# Altium schematic sheet Fri3d_2020_Time_Blaster_01.SchDoc: Time Blaster
size A3; Date: 08/01/2020; DrawnBy: Wim Van Gool; DocumentNumber: 1; Revision: 00; SheetNumber: 1; SheetTotal: 1
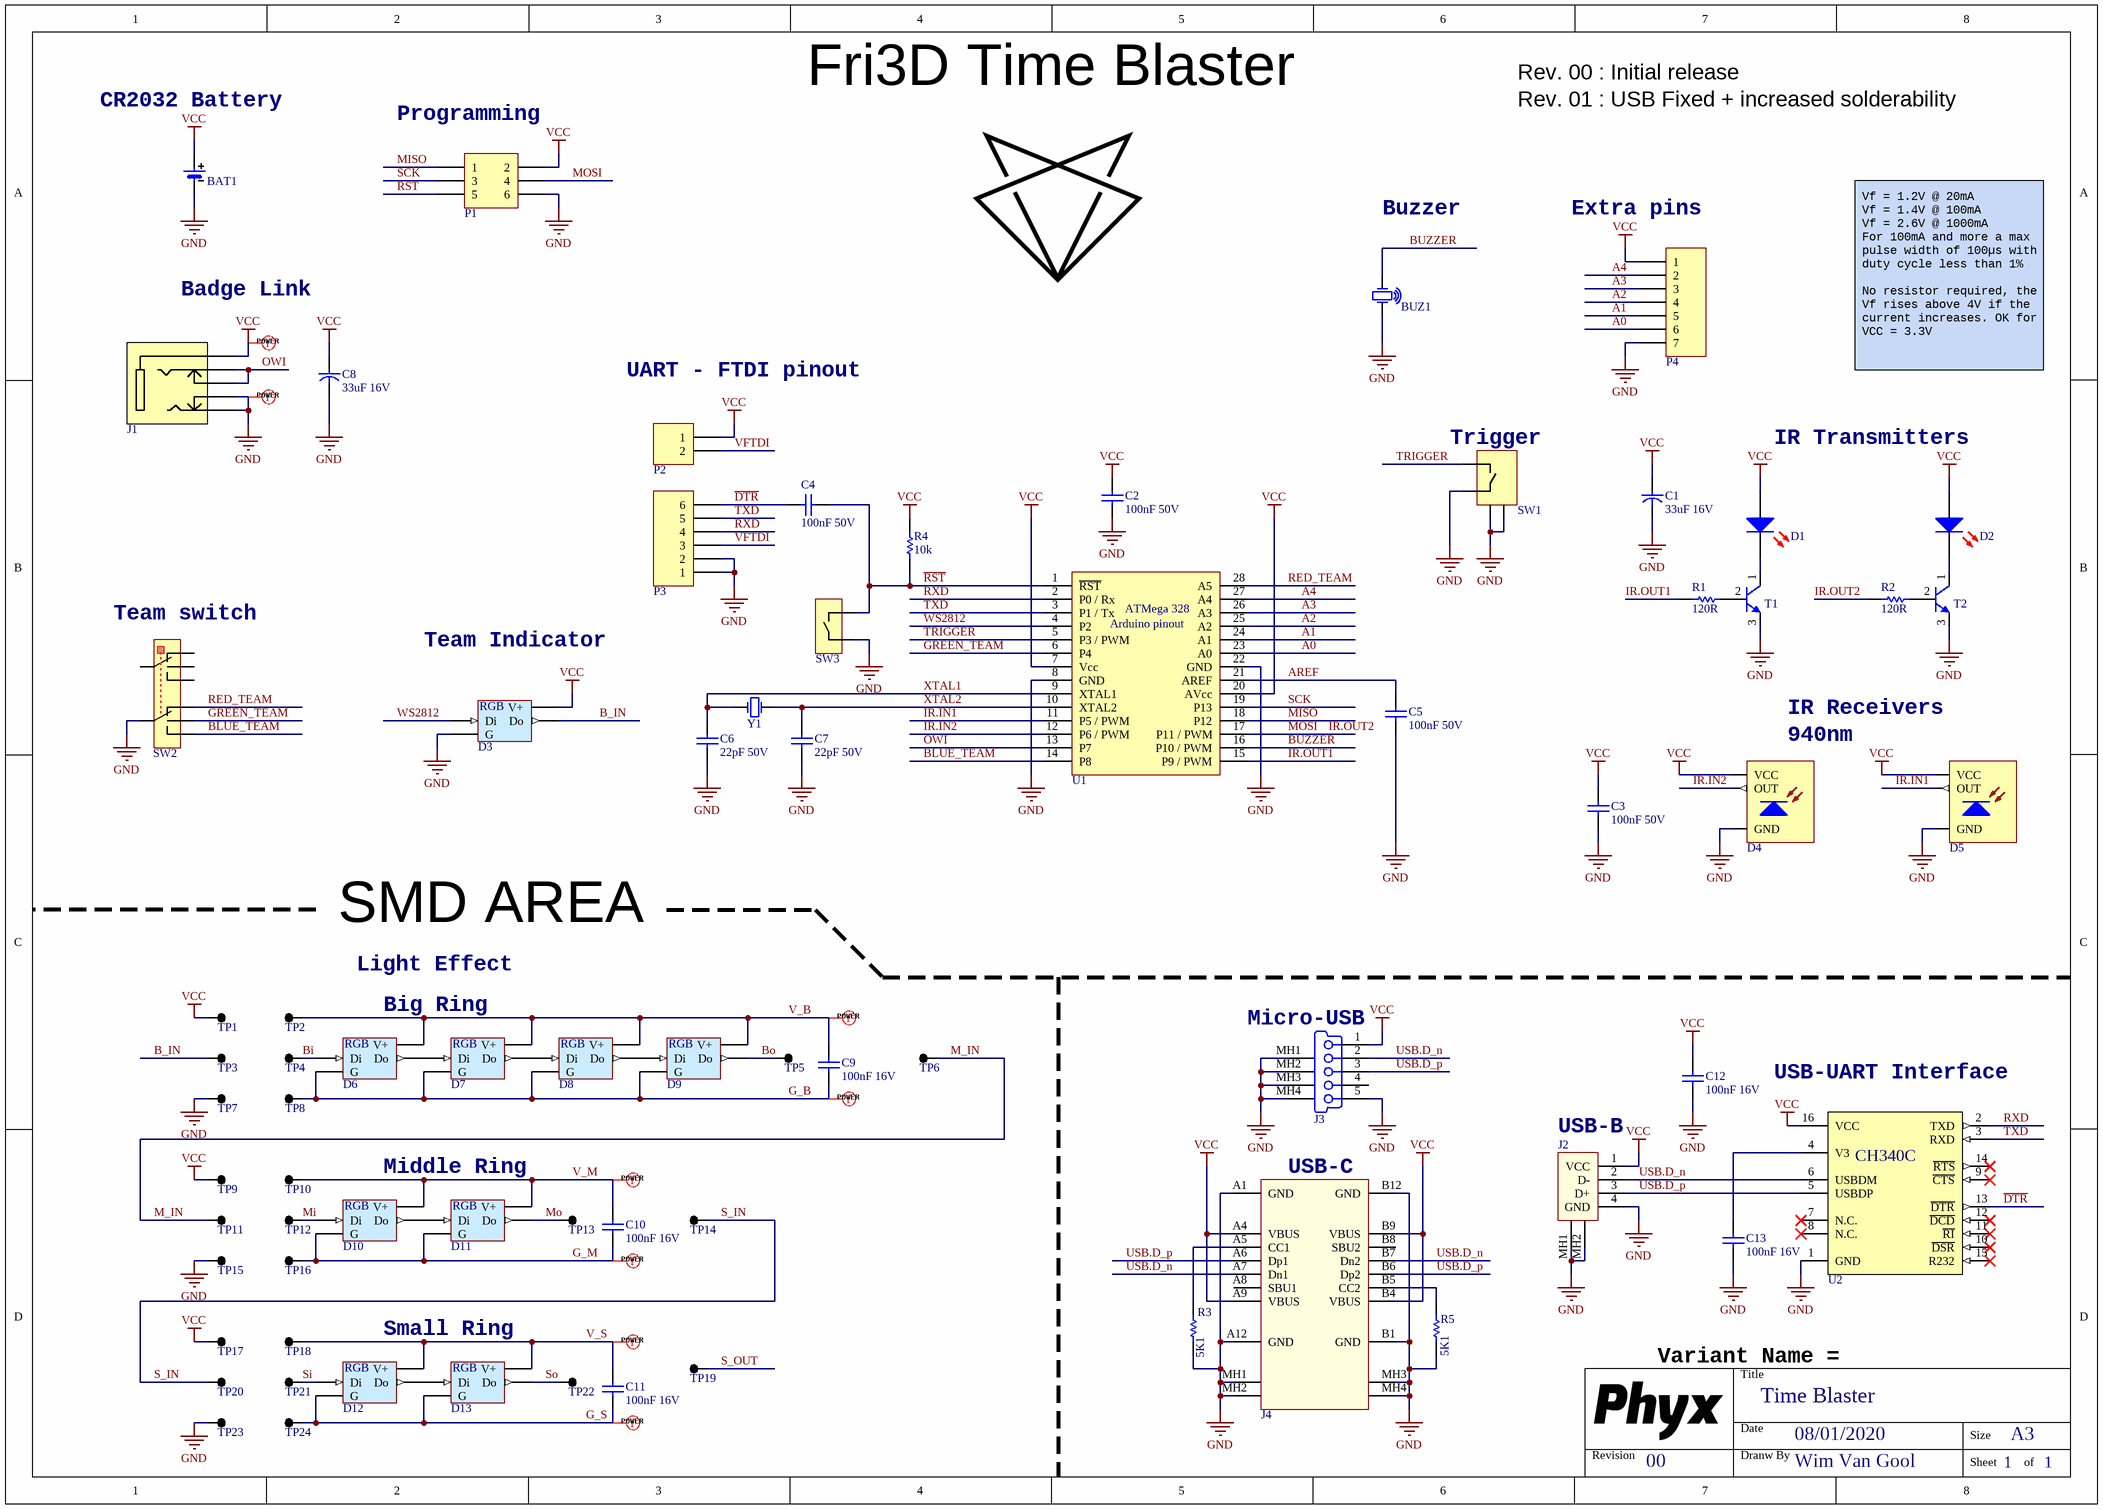
[diagram p0: Fri3d_2020_Time_Blaster_01.SchDoc]

## Parts
BAT1  CR2032 Battery Holder  [BAT_CR2032_China]  (value not drawn)
BUZ1  14x14x7mm Piezo Buzzer Transducer 80dB  [CUI_CEP-1162]  (value not drawn)
C1  value 33uF 16V  [C_4x7_1.5mm]  (hidden comment: CAP_POL)
C2  value 100nF 50V  [C_5.08mm]  (hidden comment: CAP_CERAMIC)
C3  value 100nF 50V  [C_5.08mm]  (hidden comment: CAP_CERAMIC)
C4  value 100nF 50V  [C_5.08mm]  (hidden comment: CAP_CERAMIC)
C5  value 100nF 50V  [C_5.08mm]  (hidden comment: CAP_CERAMIC)
C6  value 22pF 50V  [C_5.08mm]  (hidden comment: CAP_CERAMIC)
C7  value 22pF 50V  [C_5.08mm]  (hidden comment: CAP_CERAMIC)
C8  value 33uF 16V  [C_4x7_1.5mm]  (hidden comment: CAP_POL)
C9  value 100nF 16V  [C0805_N]  (hidden comment: CAP_CERAMIC)
C10  value 100nF 16V  [C0805_N]  (hidden comment: CAP_CERAMIC)
C11  value 100nF 16V  [C0805_N]  (hidden comment: CAP_CERAMIC)
C12  value 100nF 16V  [C0805_N]  (hidden comment: CAP_CERAMIC)
C13  value 100nF 16V  [C0805_N]  (hidden comment: CAP_CERAMIC)
D1  5mm IR LED, 940nm, 100mA, 1.35V, 25Deg  [LED_5MM_RD]  (value not drawn)
D2  5mm IR LED, 940nm, 100mA, 1.35V, 25Deg  [LED_5MM_RD]  (value not drawn)
D3  WS2812 based digital RGB LED 5mm  [LED_5mm_RGB]  (value not drawn)
D4  IRM-3638N3F14 Infrared Receiver 38 kHz 45° 2.7-5.5V  [VIS_TSOP381x_BENT]  (value not drawn)
D5  IRM-3638N3F14 Infrared Receiver 38 kHz 45° 2.7-5.5V  [VIS_TSOP381x_BENT]  (value not drawn)
D6  WS2812 based digital RGB LED 5050 Black package  [LED_5050_WS2812B_BLACK]  (value not drawn)
D7  WS2812 based digital RGB LED 5050 Black package  [LED_5050_WS2812B_BLACK]  (value not drawn)
D8  WS2812 based digital RGB LED 5050 Black package  [LED_5050_WS2812B_BLACK]  (value not drawn)
D9  WS2812 based digital RGB LED 5050 Black package  [LED_5050_WS2812B_BLACK]  (value not drawn)
D10  WS2812 based digital RGB LED 5050 Black package  [LED_5050_WS2812B_BLACK]  (value not drawn)
D11  WS2812 based digital RGB LED 5050 Black package  [LED_5050_WS2812B_BLACK]  (value not drawn)
D12  WS2812 based digital RGB LED 5050 Black package  [LED_5050_WS2812B_BLACK]  (value not drawn)
D13  WS2812 based digital RGB LED 5050 Black package  [LED_5050_WS2812B_BLACK]  (value not drawn)
J1  3.5mm jack, dual switch, black, 3 contacts  [CUI_SJ1-3525NG]  (value not drawn)
J2  Vertical USB B 61400416121  [WE_61400416121]  (value not drawn)
J3  XKB U254-051T-4BH81-S2S Micro USB  [XKB_U254-051T-4BH81-S2S]  (value not drawn)
J4  USB 2.0 C Reversible Receptacle Horizontal  [HRO_TYPE-C-31-M-12]  (value not drawn)
P1  Boxed Header 3X2  [B_HDR2X3]  (value not drawn)
P2  Easy to solder connection  [SOLDER_SW_V_1MM]  (value not drawn)
P3  Header 6  [HDR1X6]  (value not drawn)
P4  Header 7  [HDR1X7]  (value not drawn)
R1  value 120R  [RES_10mm]  (hidden comment: RESISTOR)
R2  value 120R  [RES_10mm]  (hidden comment: RESISTOR)
R3  value 5K1  [R0805_N]  (hidden comment: RESISTOR)
R4  value 10k  [RES_10mm]  (hidden comment: RESISTOR)
R5  value 5K1  [R0805_N]  (hidden comment: RESISTOR)
SW1  Tact switch, RA, 3,85mm  [TACTSW_RA_385]  (value not drawn)
SW2  Slide switch dual pole triple throw  [CK_JS203011CQN]  (value not drawn)
SW3  Default TH TACT  [TACTSW]  (value not drawn)
T1  0.2A 40V 100hfe NPN Transistor  [TO-92A _EASY]  (value not drawn)
T2  0.2A 40V 100hfe NPN Transistor  [TO-92A _EASY]  (value not drawn)
TP1  TEST_PAD  [TP_2x3mm]  (value not drawn)  (no BOM)
TP2  TEST_PAD  [TP_2x3mm]  (value not drawn)  (no BOM)
TP3  TEST_PAD  [TP_2x3mm]  (value not drawn)  (no BOM)
TP4  TEST_PAD  [TP_2x3mm]  (value not drawn)  (no BOM)
TP5  TEST_PAD  [TP_2x3mm]  (value not drawn)  (no BOM)
TP6  TEST_PAD  [TP_2x3mm]  (value not drawn)  (no BOM)
TP7  TEST_PAD  [TP_2x3mm]  (value not drawn)  (no BOM)
TP8  TEST_PAD  [TP_2x3mm]  (value not drawn)  (no BOM)
TP9  TEST_PAD  [TP_2x3mm]  (value not drawn)  (no BOM)
TP10  TEST_PAD  [TP_2x3mm]  (value not drawn)  (no BOM)
TP11  TEST_PAD  [TP_2x3mm]  (value not drawn)  (no BOM)
TP12  TEST_PAD  [TP_2x3mm]  (value not drawn)  (no BOM)
TP13  TEST_PAD  [TP_2x3mm]  (value not drawn)  (no BOM)
TP14  TEST_PAD  [TP_2x3mm]  (value not drawn)  (no BOM)
TP15  TEST_PAD  [TP_2x3mm]  (value not drawn)  (no BOM)
TP16  TEST_PAD  [TP_2x3mm]  (value not drawn)  (no BOM)
TP17  TEST_PAD  [TP_2x3mm]  (value not drawn)  (no BOM)
TP18  TEST_PAD  [TP_2x3mm]  (value not drawn)  (no BOM)
TP19  TEST_PAD  [TP_2x3mm]  (value not drawn)  (no BOM)
TP20  TEST_PAD  [TP_2x3mm]  (value not drawn)  (no BOM)
TP21  TEST_PAD  [TP_2x3mm]  (value not drawn)  (no BOM)
TP22  TEST_PAD  [TP_2x3mm]  (value not drawn)  (no BOM)
TP23  TEST_PAD  [TP_2x3mm]  (value not drawn)  (no BOM)
TP24  TEST_PAD  [TP_2x3mm]  (value not drawn)  (no BOM)
U1  8-bit MCU  [DIP_N_28]  (value not drawn)
U2  USB to full UART with internal crystal  [SOIC_N_16]  (value not drawn)
Y1  16MHz 18pF HC49US  [HC49US]  (value not drawn)

## Nets
GND: BAT1.2 BUZ1.1(OSC1) C1.2 C2.2 C3.2 C5.2 C6.2 C7.2 C8.2 C12.2 C13.2 D3.3(G) D4.2(GND) D5.2(GND) J1.2(Tip) J1.4 J2.4(GND) J2.MH1(Tab) J2.MH2(Tab) J3.5(GND) J3.MH1(Tab) J3.MH2(Tab) J3.MH3(Tab) J3.MH4(Tab) J4.A1(GND) J4.A12(GND) J4.B1(GND) J4.B12(GND) J4.MH1(Tab) J4.MH2(Tab) J4.MH3(Tab) J4.MH4(Tab) P1.6 P3.1 P3.2 P4.7 R3.2 R5.2 SW1.2 SW1.MH1 SW1.MH2 SW2.7 SW3.2 T1.3(E) T2.3(E) TP7.1 TP15.1 TP23.1 U1.8(GND) U1.22(GND) U2.1(GND)
VCC: BAT1.1 C1.1 C2.1 C3.1 C8.1 C12.1 D1.1(A) D2.1(A) D3.2(V+) D4.3(VCC) D5.3(VCC) J1.1(Sleeve) J2.1(VCC) J3.1(V_BUS_(5V)) J4.A4(VBUS) J4.A9(VBUS) J4.B4(VBUS) J4.B9(VBUS) P1.2 P2.1 P4.1 R4.1 TP1.1 TP9.1 TP17.1 U1.7(Vcc) U1.20(AVcc) U2.16(VCC)
A0: P4.6 U1.23(A0)
A1: P4.5 U1.24(A1)
A2: P4.4 U1.25(A2)
A3: P4.3 U1.26(A3)
A4: P4.2 U1.27(A4)
AREF: C5.1 U1.21(AREF)
B_IN: D3.1(Do) TP3.1
Bi: D6.4(Di) TP4.1
BLUE_TEAM: SW2.8 U1.14(P8)
Bo: D9.2(Do) TP5.1
BUZZER: BUZ1.2(OSC2) U1.16(P10_/_PWM)
~{DTR}: C4.2 P3.6 U2.13(~{DTR})
G_B: C9.2 D6.3(G) D7.3(G) D8.3(G) D9.3(G) TP8.1
G_M: C10.2 D10.3(G) D11.3(G) TP16.1
G_S: C11.2 D12.3(G) D13.3(G) TP24.1
GREEN_TEAM: SW2.6 U1.6(P4)
IR.IN1: D5.1(OUT) U1.11(P5_/_PWM)
IR.IN2: D4.1(OUT) U1.12(P6_/_PWM)
IR.OUT1: R1.2 U1.15(P9_/_PWM)
IR.OUT2: P1.4 R2.2 U1.17(P11_/_PWM)  [also labelled MOSI]
M_IN: TP6.1 TP11.1
Mi: D10.4(Di) TP12.1
MISO: P1.1 U1.18(P12)
Mo: D11.2(Do) TP13.1
OWI: J1.3(Ring) J1.5 U1.13(P7)
~{RST}: C4.1 P1.5 R4.2 SW3.1 U1.1(~{RST})
RED_TEAM: SW2.5 U1.28(A5)
RXD: P3.4 U1.2(P0_/_Rx) U2.2(TXD)
S_IN: TP14.1 TP20.1
S_OUT: TP19.1
SCK: P1.3 U1.19(P13)
Si: D12.4(Di) TP21.1
So: D13.2(Do) TP22.1
TRIGGER: SW1.1 U1.5(P3_/_PWM)
TXD: P3.5 U1.3(P1_/_Tx) U2.3(RXD)
USB.D_n: J2.2(D-) J3.2(D-) J4.A7(Dn1) J4.B7(Dn2) U2.6(USBDM)
USB.D_p: J2.3(D+) J3.3(D+) J4.A6(Dp1) J4.B6(Dp2) U2.5(USBDP)
V_B: C9.1 D6.1(V+) D7.1(V+) D8.1(V+) D9.1(V+) TP2.1
V_M: C10.1 D10.1(V+) D11.1(V+) TP10.1
V_S: C11.1 D12.1(V+) D13.1(V+) TP18.1
VFTDI: P2.2 P3.3
WS2812: D3.4(Di) U1.4(P2)
XTAL1: C6.1 U1.9(XTAL1) Y1.1(OSC1)
XTAL2: C7.1 U1.10(XTAL2) Y1.2(OSC2)
NetC13_1: C13.1 U2.4(V3)
NetD1_2: D1.2(K) T1.1(C)
NetD2_2: D2.2(K) T2.1(C)
NetD6_2: D6.2(Do) D7.4(Di)
NetD7_2: D7.2(Do) D8.4(Di)
NetD8_2: D8.2(Do) D9.4(Di)
NetD10_2: D10.2(Do) D11.4(Di)
NetD12_2: D12.2(Do) D13.4(Di)
NetJ4_A5: J4.A5(CC1) R3.1
NetJ4_B5: J4.B5(CC2) R5.1
NetR1_1: R1.1 T1.2(B)
NetR2_1: R2.1 T2.2(B)

Not connected (* = marked no-connect by the designer): J3 4(NC); J4 A8(SBU1) B8(SBU2); SW2 1 2 3 4; U2 7(N.C.)* 8(N.C.)* 9(~{CTS})* 10(~{DSR})* 11(~{RI})* 12(~{DCD})* 14(~{RTS})* 15(R232)*

## Layout directives
net class POWER: G_B, G_M, G_S, GND, V_B, V_M, V_S, VCC

## Notes on the sheet
- CR2032 Battery
- Fri3D Time Blaster
- Rev. 00 : Initial release
- Rev. 01 : USB Fixed + increased solderability
- (near P1) Programming
- Buzzer
- (near P4) Extra pins
- Badge Link
- UART - FTDI pinout
- Vf = 1.2V @ 20mA
  Vf = 1.4V @ 100mA
  Vf = 2.6V @ 1000mA
  For 100mA and more a max pulse width of 100µs with duty cycle less than 1%
  No resistor required, the Vf rises above 4V if the current increases. OK for VCC = 3.3V
- (near SW1) Trigger
- IR Transmitters
- (near SW2) Team switch
- Team Indicator
- IR Receivers
- (near D4) 940nm
- Light Effect
- SMD AREA
- Big Ring
- (near J3) Micro-USB
- (near U2) USB-UART Interface
- Middle Ring
- (near J4) USB-C
- (near J2) USB-B
- Small Ring
- Variant Name =
- Title
- Revision
- Date
- Dranw By
- Size
- A3
- Sheet
- of
- (in symbol AVR ATMega 328p MCU PDIP) ATMega 328; Arduino pinout
- (in symbol LED # RGB WS2812B-5050 BL) RGB
- (in symbol LED RGB WS2812 5mm) RGB

## Library data of the parts
BAT1 = BAT 20mm Coin Cell Holder Generic: =Description; Value: CR2032; Supplier 1: China
BUZ1 = BUZ CUI CEP-1162: Crystal Oscillator; Value: CMT-1203-SMT; Supplier 1: Digi-key; Supplier Part Number 1: 102-1134-ND; Supplier 2: LCSC; Supplier Part Number 2: C360604
C1 C8 = CAP 13uF 16V 4x7: Capacitor electrolyt; Supplier 1: LCSC; Supplier Part Number 1: C3314
C2-C5 = CAP 100nF 50V 5.08mm: Capacitor Ceramic; Supplier 1: LCSC; Supplier Part Number 1: C84772
C6 C7 = CAP 22pF 50V 5.08mm: Capacitor Ceramic; Supplier 1: LCSC; Supplier Part Number 1: C263190
C9-C13 = CAP # 100nF 16V 0805: Capacitor Ceramic
D1 D2 = LED IR 5mm TSAL6400: =Description; Value: TSAL6400; Supplier 1: Farnell; Supplier Part Number 1: 3152868
D3 = LED RGB WS2812 5mm: =Description; Value: WS2812D-F5; Supplier 1: LCSC; Supplier Part Number 1: C190565
D4 D5 = PHO IR Rx RA: =Description; Value: IRM-3638N3F14; Supplier 1: LCSC; Supplier Part Number 1: C264262
D6-D13 = LED # RGB WS2812B-5050 BL: =Description; Value: WS218B 5050 BL; Supplier 1: Aliexpress; Supplier Part Number 1: WS2812B Black 5050
J1 = AUDIO JACK 3.5 3c SJ1-3525NG: =Description; Value: SJ1-3525NG; Supplier 1: Digi-key; Supplier Part Number 1: CP1-3525NG-ND
J2 = USB B VERTICAL 61400416121: Value: 61400416121; Supplier 1: Farnell; Supplier Part Number 1: 1642035; Supplier 2: LCSC; Supplier Part Number 2: C46392
J3 = USB # Micro B TH XKB U254-051T-4BH81-S2S: Value: U254-051T-4BH81-S2S; Supplier 1: LCSC; Supplier Part Number 1: C381144
J4 = USB # C 2.0 RCPT TYPE-C-31-M-12: Value: TYPE-C-31-M-12; Supplier 1: China; Supplier Part Number 1: HRO TYPE-C-31-M-12; Supplier 2: LCSC; Supplier Part Number 2: C165948; Supplier 3: LCSC ALT; Supplier Part Number 3: C167321 / C319148
P1 = Pin Header 2.54mm dual row 6way Boxed
P2 = SOLDER SW V 1MM: Value: NO BOM
P3 = Pin Header 2.54mm 6way
P4 = Pin Header 2.54mm 7way
R1 R2 = RES 120R 1/4W: Supplier 1: LCSC; Supplier Part Number 1: C58684
R3 R5 = RES # 5K1 0805
R4 = RES 10k 1/4W: Supplier 1: LCSC; Supplier Part Number 1: C58673
SW1 = SW TACT RA 3,85mm 431256038716: Value: 431256038716; Supplier 1: Wurth; Supplier Part Number 1: 431256038716; Supplier 2: Mouser; Supplier Part Number 2: 710-431256038716
SW2 = SW Slide DP3T C&K JS203011CQN: Value: JS203011CQN; Supplier 1: Digi-key; Supplier Part Number 1: 401-2004-ND; Supplier 2: LCSC; Supplier Part Number 2: K3-2336D-F1
SW3 = SW TACT
T1 T2 = 2N3904 NPN 0.2A: Value: 2N3904; Supplier 1: Farnell; Supplier Part Number 1: 1700648; Supplier 2: LCSC; Supplier Part Number 2: C118538
TP1-TP24 = TP # 2x3mm: Value: NO BOM; Supplier 1: XXX; Supplier Part Number 1: FOOTPRINT ONLY
U1 = AVR ATMega 328p MCU PDIP: Value: ATMega 328p; Supplier 1: LCSC; Supplier Part Number 1: C33901; Supplier 2: Mouser; Supplier Part Number 2: 556-ATMEGA328P-PU
U2 = CH340C # UCB UART: =Description; Value: CH340C; Supplier 1: LCSC; Supplier Part Number 1: C84681
Y1 = XTAL 16Mhz HC49US: Crystal Oscillator; Value: 16MHz; Supplier 1: Farnell; Supplier Part Number 1: 2508458